# Altium schematic sheet First Project.SchDoc
size A4; SheetNumber: 1; SheetTotal: 1
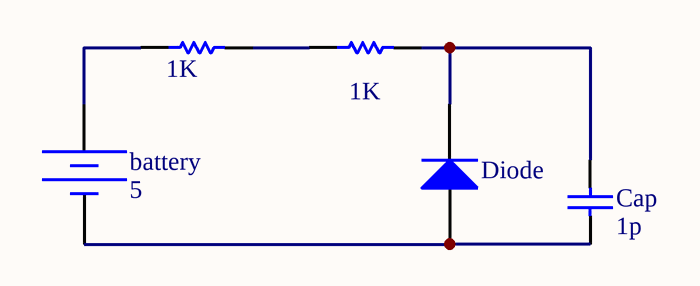
[diagram p0: First Project.SchDoc]

## Parts
battery  DC Magnitude: 5  (hidden comment: Constant Voltage Source)
Cap  value 1p  (hidden comment: Capacitor)
Diode  Diode  (value not drawn)
R1  1K
R2  1K

## Nets
Netbattery_1: battery.1 R1.1
Netbattery_2: battery.2 Cap.1 Diode.1(A)
NetCap_2: Cap.2 Diode.2(K) R2.2
NetR1_2: R1.2 R2.1

## Library data of the parts
battery = Battery: SimulationGenericComponent: True
Cap = Capacitor: SimulationGenericComponent: True
Diode = Diode: AF: 1; BV: 0; BV_MAX: 1e99; EG: 1.11; FC: 0.5; IBV: 0.001; ISR: 1e-14; MJSW: 0.33; NTUN: 30; TNOM: 27; XTI: 3; SimulationGenericComponent: True; CJO: 0; CJP: 0; CTA: 0; CTP: 0; FCS: 0.5; FV_MAX: 1e99; IKF: 0; IKR: 0; JSW: 0; JTUN: 0; JTUNSW: 0; KEG: 1; KF: 0; LEVEL: 1; N: 1; NBV: 1; NR: 1; NS: 1; PHP: 1; RS: 0; TCV: 0; TLEV: 0; TLEVC: 0; TM1: 0; TM2: 0; TPB: 0; TPHP: 0; TRS: 0; TRS2: 0; TT: 0; TTT1: 0; TTT2: 0; VJ: 1; XTITUN: 3; IS: 1e-14
R1 R2 = Resistor: TC1: 0; SimulationGenericComponent: True; TC2: 0; Value: 1K